# EAGLE design ABoatMon (EAGLE 9.5.2)
CNAME: MoteinoMega ABoatMon Shield; CREVISION: 0.92; DESIGNER: gregcope@gmail.com
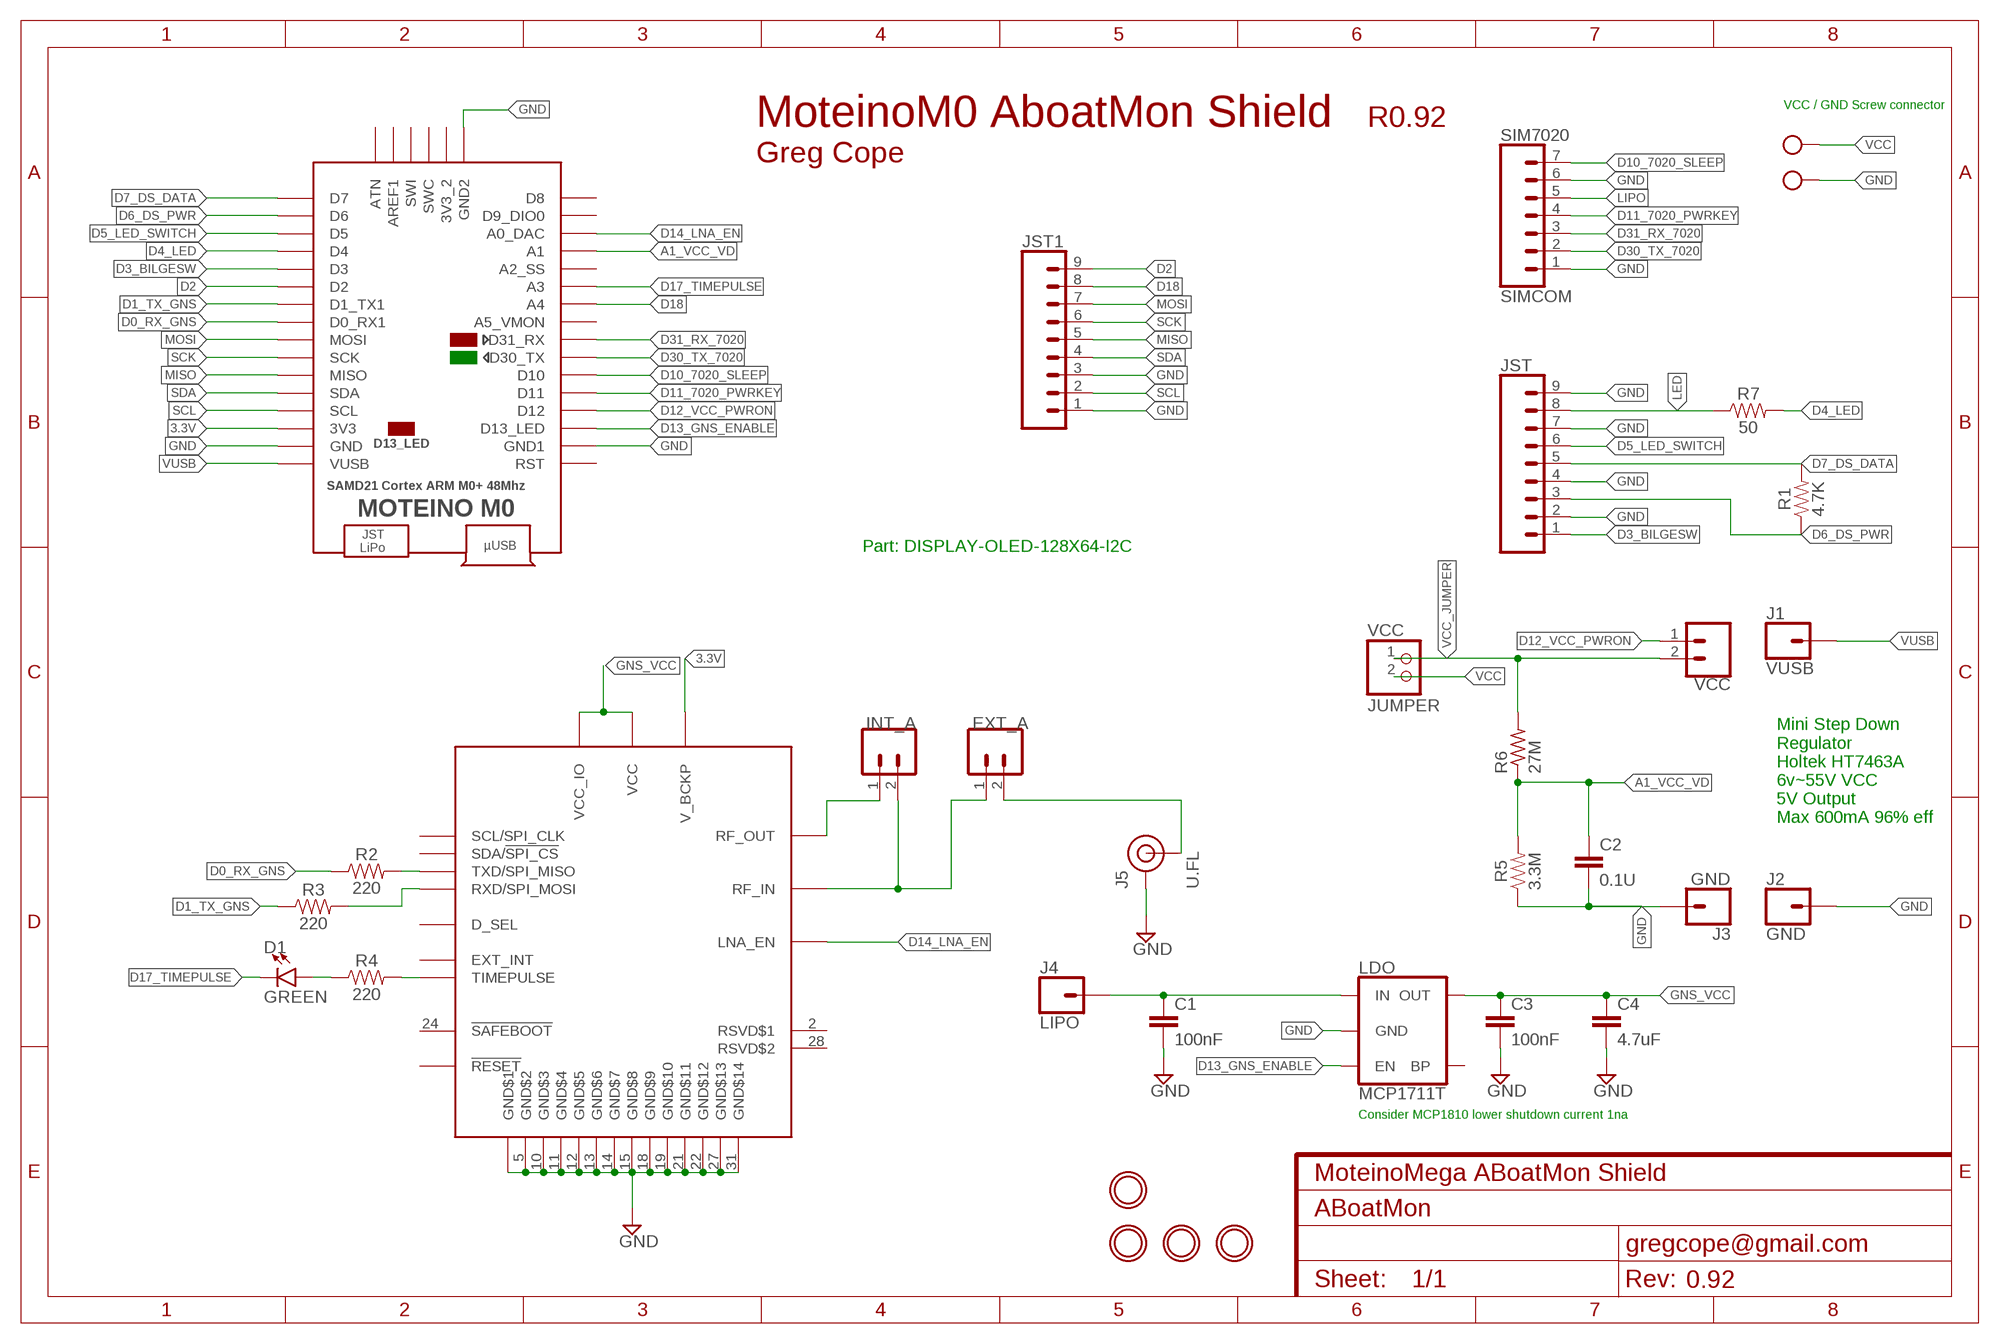
[diagram p0: schematic, sheet 1]

## Parts
C1  100nF  0.1UF-0603-25V-5%  [0603]
C2  0.1U  0.1UF-KIT-EZ-50V-20%  [CAP-PTH-SMALL-KIT]
C3  100nF  0.1UF-0603-25V-5%  [0603]
C4  4.7uF  4.7UF0603  [0603]
D1  GREEN  LED-GREEN0603  [LED-0603]
ENABLE  VCC  CONN_02  [1X02]
EXT_A  CONN_02  [1X02]
GND  MOUNTINGHOLE2.5  [MOUNTINGHOLE_2.5_PLATED]
INT_A  CONN_02  [1X02]
J1  VUSB  CONN_01  [1X01]
J2  GND  CONN_01  [1X01]
J3  GND  CONN_01  [1X01]
J4  LIPO  CONN_01  [1X01]
J5  U.FL  U.FL2PIN  [U.FL]
JST  CONN_09  [1X09]
JST1  CONN_09  [1X09]
LDO  MCP1711T  V_REG_SPX3819-SOT23-5  [SOT23-5]
R1  4.7K  1KOHM-HORIZ-1/4W-1%  [AXIAL-0.3]
R2  220  220OHM-0603-1/10W-1%  [0603]
R3  220  220OHM-0603-1/10W-1%  [0603]
R4  220  220OHM-0603-1/10W-1%  [0603]
R5  3.3M  1KOHM-HORIZ-1/4W-1%  [AXIAL-0.3]
R6  27M  R-US_0309/12  [0309/12]
R7  50  1KOHM-HORIZ-1/4W-1%  [AXIAL-0.3]
SIM7020  SIMCOM  CONN_07  [1X07]
U$3  MOUNTINGHOLE2.0  [MOUNTINGHOLE_2.0_PLATED]
U$5  CAM-M8  [CAM-M8]
U$6  MOTEINO_M0  [MOTEINO_M0]
U$7  MOUNTINGHOLE2.5  [MOUNTINGHOLE_2.5_PLATED]
U$9  MOUNTINGHOLE2.0  [MOUNTINGHOLE_2.0_PLATED]
VCC  JUMPER  HEADER-1X2ROUND  [1X02_ROUND]
X1  MKDSN1,5/2-5,08  [MKDSN1,5/2-5,08]

## Nets
3.3V [gns]: U$5.8(V_BCKP) U$6.3V3
A1_VCC_VD: C2.1 R5.P$2 R6.1 U$6.A1
D0_RX_GNS: R2.1 U$6.D0_RX1
D1_TX_GNS: R3.1 U$6.D1_TX1
D2: JST1.9 U$6.D2
D3_BILGESW: JST.1 U$6.D3
D4_LED: R7.P$2 U$6.D4
D5_LED_SWITCH: JST.6 U$6.D5
D6_DS_PWR: JST.3 R1.P$1 U$6.D6
D7_DS_DATA: JST.5 R1.P$2 U$6.D7
D10_7020_SLEEP: SIM7020.7 U$6.D10
D11_7020_PWRKEY: SIM7020.4 U$6.D11
D12_VCC_PWRON: ENABLE.1 U$6.D12
D13_GNS_ENABLE: LDO.3(EN) U$6.D13(D13_LED)
D14_LNA_EN: U$5.30(LNA_EN) U$6.A0_DAC
D17_TIMEPULSE: D1.C U$6.A3
D18: JST1.8 U$6.A4
D30_TX_7020: SIM7020.2 U$6.D30_TX
D31_RX_7020: SIM7020.3 U$6.D31_RX
GND [power]: C1.2 C2.2 C3.2 C4.2 J2.1 J3.1 J5.1(GND) J5.2(GND) JST1.1 JST1.3 JST.2 JST.4 JST.7 JST.9 LDO.2(GND) R5.P$1 SIM7020.1 SIM7020.6 U$5.4(GND$1) U$5.5(GND$2) U$5.10(GND$3) U$5.11(GND$4) U$5.12(GND$5) U$5.13(GND$6) U$5.14(GND$7) U$5.15(GND$8) U$5.18(GND$9) U$5.19(GND$10) U$5.21(GND$11) U$5.22(GND$12) U$5.27(GND$13) U$5.31(GND$14) U$6.GND U$6.GND_1(GND1) U$6.GND_2(GND2) X1.2
GNS_VCC [gns]: C3.1 C4.1 LDO.5(OUT) U$5.1(VCC_IO) U$5.9(VCC)
LED: JST.8 R7.P$1
LIPO: C1.1 J4.1 LDO.1(IN) SIM7020.5
MISO: JST1.5 U$6.MISO
MOSI: JST1.7 U$6.MOSI
N$1: R4.2 U$5.29(TIMEPULSE)
N$2 [gns]: R2.2 U$5.25(TXD/SPI_MISO)
N$3 [gns]: R3.2 U$5.26(RXD/SPI_MOSI)
N$4: D1.A R4.1
N$5 [gns]: EXT_A.1 INT_A.2 U$5.17(RF_IN)
N$6 [power]: EXT_A.2 J5.FEED(SIGNAL)
N$7 [gns]: INT_A.1 U$5.16(RF_OUT)
SCK: JST1.6 U$6.SCK
SCL: JST1.2 U$6.SCL
SDA: JST1.4 U$6.SDA
VCC [power]: VCC.2 X1.1
VCC_JUMPER [power]: ENABLE.2 R6.2 VCC.1
VUSB [power]: J1.1 U$6.VUSB
Unconnected: LDO.4(BP) U$5.2(RSVD$1) U$5.3(SDA/!SPI_CS) U$5.6(SCL/SPI_CLK) U$5.7(EXT_INT) U$5.20(D_SEL) U$5.23(!RESET) U$5.24(!SAFEBOOT) U$5.28(RSVD$2) U$6.3V3_2 U$6.A2(A2_SS) U$6.A5(A5_VMON) U$6.AREF(AREF1) U$6.ATN U$6.D8 U$6.D9(D9_DIO0) U$6.RST U$6.SWC U$6.SWI

## Notes on the sheet
- VCC / GND Screw connector
- MoteinoM0 AboatMon Shield | R0.92
- Greg Cope
- Part: DISPLAY-OLED-128X64-I2C
- Mini Step Down 
  Regulator
  Holtek HT7463A
  6v~55V VCC
  5V Output
  Max 600mA 96% eff
- Consider MCP1810 lower shutdown current 1na

## Library data of the parts
C1 C3 = SparkFun-Capacitors:0.1UF: 0.1µF ceramic capacitors A capacitor is a passive two-terminal electrical component used to store electrical energy temporarily in an electric field.; PROD_ID: CAP-08604; VALUE: 0.1uF
C2 = SparkFun-Capacitors:0.1UF: 0.1µF ceramic capacitors A capacitor is a passive two-terminal electrical component used to store electrical energy temporarily in an electric field.; PROD_ID: CAP-08370; VALUE: 0.1uF
C4 = SparkFun-Capacitors:4.7UF: 4.7µF ceramic capacitors A capacitor is a passive two-terminal electrical component used to store electrical energy temporarily in an electric field.; PROD_ID: CAP-08280
D1 = SparkFun-LED:LED-GREEN: Green SMD LED Used in manufacturing of various products at SparkFun Packages: 0603 - SMD 0603 package [Product Link] <http://www.futureelectronics.com/en/technologies/semiconductors/optoelectronics/leds/Pages/9894312-LTST-C190GKT.aspx?CrossPart=HSMG-C190&IM=0> LilyPad 1206 - SMD1206 LilyPad package [Product Link] <http://www.futureelectronics.com/en/Technologies/Product.aspx?ProductID=IN150NGHARVATEKCORPORATION2049943&IM=0> 1206 - SMD1206 package [Product Link] <http://www.futureelectronics.com/en/technologies/semiconductors/optoelectronics/leds/Pages/8315665-LTST-C150KGKT.aspx?IM=0> 1206 Bottom Mount -SMD 1206 Bottom Mount [Product Link] <http://www.digikey.com/product-detail/en/lite-on-inc/LTST-C230KGKT/160-1456-1-ND/386854> SparkFun Products: Pro Mini 328 -5V <https://www.sparkfun.com/products/821> RedBoard <https://www.sparkfun.com/products/12757> MP3 Trigger <https://www.sparkfun.com/products/13720> Makey Makey <https://www.sparkfun.com/products/11076>; PROD_ID: DIO-00821
ENABLE EXT_A INT_A = SparkFun-Connectors:CONN_02: Multi connection point. Often used as Generic Header-pin footprint for 0.1 inch spaced/style header connections On any of the 0.1 inch spaced packages, you can populate with these: Break Away Headers - Straight <https://www.sparkfun.com/products/116> (PRT-00116) Break Away Male Headers - Right Angle <https://www.sparkfun.com/products/553> (PRT-00553) Female Headers <https://www.sparkfun.com/products/115> (PRT-00115) Break Away Headers - Machine Pin <https://www.sparkfun.com/products/117> (PRT-00117) Break Away Female Headers - Swiss Machine Pin <https://www.sparkfun.com/products/743> (PRT-00743) For SCREWTERMINALS and SPRING TERMINALS visit here: Screw Terimnals on SparkFun.com <https://www.sparkfun.com/search/results?term=Screw+Terminals> (5mm/3.5mm/2.54mm spacing) This device is also useful as a general connection point to wire up your design to another part of your project. Our various solder wires solder well into these plated through hole pads. Hook-Up Wire - Assortment (Stranded, 22 AWG) <https://www.sparkfun.com/products/11375> (PRT-11375) Hook-Up Wire - Assortment (Solid Core, 22 AWG) <https://www.sparkfun.com/products/11367> (PRT-11367) View the entire wire category on our website here <https://www.sparkfun.com/categories/141> Special notes: Molex polarized connector foot print use with: PRT-08233 with associated crimp pins and housings. 2.54_SCREWTERM for use with PRT-10571. 3.5mm Screw Terminal footprints for PRT-08084 5mm Screw Terminal footprints for use with PRT-08432
GND U$3 U$7 U$9 = microbuilder:MOUNTINGHOLE: Mounting Hole For #2 screws (0.086"/2.18mm width, 0.094"/2.4mm hole) use 2.5mm
J1-J4 = SparkFun-Connectors:CONN_01: Single connection point. Often used as Generic Header-pin footprint for 0.1 inch spaced/style header connections On any of the 0.1 inch spaced packages, you can populate with these: Break Away Headers - Straight <https://www.sparkfun.com/products/116> (PRT-00116) Break Away Male Headers - Right Angle <https://www.sparkfun.com/products/553> (PRT-00553) Female Headers <https://www.sparkfun.com/products/115> (PRT-00115) Break Away Headers - Machine Pin <https://www.sparkfun.com/products/117> (PRT-00117) Break Away Female Headers - Swiss Machine Pin <https://www.sparkfun.com/products/743> (PRT-00743) This device is also useful as a general connection point to wire up your design to another part of your project. Our various solder wires solder well into these plated through hole pads. Hook-Up Wire - Assortment (Stranded, 22 AWG) <https://www.sparkfun.com/products/11375> (PRT-11375) Hook-Up Wire - Assortment (Solid Core, 22 AWG) <https://www.sparkfun.com/products/11367> (PRT-11367) View the entire wire category on our website here <https://www.sparkfun.com/categories/141> Special notes: SMTSO-256-ET is a "flush mount" nut for a 4-40 screw. We mostly use this on specialty testbeds; it is a nice way to connect hardware to your PCB at an adjustable hieght. Also note, the SNAP packages are for using a snappable style connector. We sell a baggie of snaps and they are also used on two LilyPad designs: Snap Assortment - 30 pack (male and female) <https://www.sparkfun.com/products/11347> (DEV-11347) LilyPad Arduino SimpleSnap <https://www.sparkfun.com/products/10941> (DEV-10941) LilyPad SimpleSnap Protoboard <https://www.sparkfun.com/products/10940> (DEV-10940)
J5 = SparkFun-Connectors:U.FL2PIN: SMD Antenna Connector - U.FL 2mm height, 3.0mm x 3.0mm receptacle size. SparkFun Products: SparkFun WiFi Shield - ESP8266 <https://www.sparkfun.com/products/13287> SparkFun ESP8266 Thing <https://www.sparkfun.com/products/13231> SparkFun MiniGen - Pro Mini Signal Generator Shield <https://www.sparkfun.com/products/11420>; PROD_ID: CONN-09193; SF_ID: WRL-09144
JST JST1 = SparkFun-Connectors:CONN_09: Multi connection point. Often used as Generic Header-pin footprint for 0.1 inch spaced/style header connections On any of the 0.1 inch spaced packages, you can populate with these: Break Away Headers - Straight <https://www.sparkfun.com/products/116> (PRT-00116) Break Away Male Headers - Right Angle <https://www.sparkfun.com/products/553> (PRT-00553) Female Headers <https://www.sparkfun.com/products/115> (PRT-00115) Break Away Headers - Machine Pin <https://www.sparkfun.com/products/117> (PRT-00117) Break Away Female Headers - Swiss Machine Pin <https://www.sparkfun.com/products/743> (PRT-00743) For SCREWTERMINALS and SPRING TERMINALS visit here: Screw Terimnals on SparkFun.com <https://www.sparkfun.com/search/results?term=Screw+Terminals> (5mm/3.5mm/2.54mm spacing) This device is also useful as a general connection point to wire up your design to another part of your project. Our various solder wires solder well into these plated through hole pads. Hook-Up Wire - Assortment (Stranded, 22 AWG) <https://www.sparkfun.com/products/11375> (PRT-11375) Hook-Up Wire - Assortment (Solid Core, 22 AWG) <https://www.sparkfun.com/products/11367> (PRT-11367) View the entire wire category on our website here <https://www.sparkfun.com/categories/141> Special notes: Molex polarized connector foot print use with SKU : PRT-08231 with associated crimp pins and housings. 1MM SMD Version SKU: PRT-10208 NOTES ON THE VARIANTS LOCK and LOCK_LONGPADS... This footprint was designed to help hold the alignment of a through-hole component (i.e. 6-pin header) while soldering it into place. You may notice that each hole has been shifted either up or down by 0.005 of an inch from it's more standard position (which is a perfectly straight line). This slight alteration caused the pins (the squares in the middle) to touch the edges of the holes. Because they are alternating, it causes a "brace" to hold the component in place. 0.005 has proven to be the perfect amount of "off-center" position when using our standard breakaway headers. Although looks a little odd when you look at the bare footprint, once you have a header in there, the alteration is very hard to notice. Also,if you push a header all the way into place, it is covered up entirely on the bottom side.
LDO = SparkFun-IC-Power:V_REG_SPX3819: SPX3819 Voltage Regulator 3.3V 500mA, 16V input Datasheet <https://www.exar.com/content/document.ashx?id=22106> SparkFun Products: SparkFun Serial Controlled Motor Driver <https://www.sparkfun.com/products/13911>; PROD_ID: VREG-13321; VALUE: SPX3819M5_3_3
R1 R5 R7 = SparkFun-Resistors:1KOHM: 1kΩ resistor A resistor is a passive two-terminal electrical component that implements electrical resistance as a circuit element. Resistors act to reduce current flow, and, at the same time, act to lower voltage levels within circuits. - Wikipedia; PROD_ID: RES-12182; VALUE: 1k
R2-R4 = SparkFun-Resistors:220OHM: 220Ω resistor A resistor is a passive two-terminal electrical component that implements electrical resistance as a circuit element. Resistors act to reduce current flow, and, at the same time, act to lower voltage levels within circuits. - Wikipedia; PROD_ID: RES-07861
R6 = adafruit:R-US_: RESISTOR, American symbol
SIM7020 = SparkFun-Connectors:CONN_07: Multi connection point. Often used as Generic Header-pin footprint for 0.1 inch spaced/style header connections On any of the 0.1 inch spaced packages, you can populate with these: Break Away Headers - Straight <https://www.sparkfun.com/products/116> (PRT-00116) Break Away Male Headers - Right Angle <https://www.sparkfun.com/products/553> (PRT-00553) Female Headers <https://www.sparkfun.com/products/115> (PRT-00115) Break Away Headers - Machine Pin <https://www.sparkfun.com/products/117> (PRT-00117) Break Away Female Headers - Swiss Machine Pin <https://www.sparkfun.com/products/743> (PRT-00743) For SCREWTERMINALS and SPRING TERMINALS visit here: Screw Terimnals on SparkFun.com <https://www.sparkfun.com/search/results?term=Screw+Terminals> (5mm/3.5mm/2.54mm spacing) This device is also useful as a general connection point to wire up your design to another part of your project. Our various solder wires solder well into these plated through hole pads. Hook-Up Wire - Assortment (Stranded, 22 AWG) <https://www.sparkfun.com/products/11375> (PRT-11375) Hook-Up Wire - Assortment (Solid Core, 22 AWG) <https://www.sparkfun.com/products/11367> (PRT-11367) View the entire wire category on our website here <https://www.sparkfun.com/categories/141> Special notes: Molex polarized connector foot print use with SKU : PRT-08231 with associated crimp pins and housings. 1MM SMD Version SKU: PRT-10208 NOTES ON THE VARIANTS LOCK and LOCK_LONGPADS... This footprint was designed to help hold the alignment of a through-hole component (i.e. 6-pin header) while soldering it into place. You may notice that each hole has been shifted either up or down by 0.005 of an inch from it's more standard position (which is a perfectly straight line). This slight alteration caused the pins (the squares in the middle) to touch the edges of the holes. Because they are alternating, it causes a "brace" to hold the component in place. 0.005 has proven to be the perfect amount of "off-center" position when using our standard breakaway headers. Although looks a little odd when you look at the bare footprint, once you have a header in there, the alteration is very hard to notice. Also,if you push a header all the way into place, it is covered up entirely on the bottom side.
U$5 = ubloxLib:CAM-M8: CAM-M8x: M8 Concurrent GNSS Antenna Module u-blox.com
U$6 = Moteino:MOTEINO_M0
VCC = microbuilder:HEADER-1X2: PIN HEADER
X1 = con-phoenix-508:MKDSN1,5/2-5,08: MKDSN 1,5/ 2-5,08 Printklemme Nennstrom: 13,5 A Nennspannung: 250 V Rastermaß: 5,08 mm Polzahl: 2 Anschlussart: Schraubanschluss Montage: Löten Anschlussrichtung Leiter/Platine: 0 ° Artikelnummer: 1729128 Source: http://eshop.phoenixcontact.com .. 1729128.pdf

## Net classes
0 default: width 0.457 mm, clearance 0.305 mm
1 power: width 0.61 mm, clearance 0.406 mm

## Board
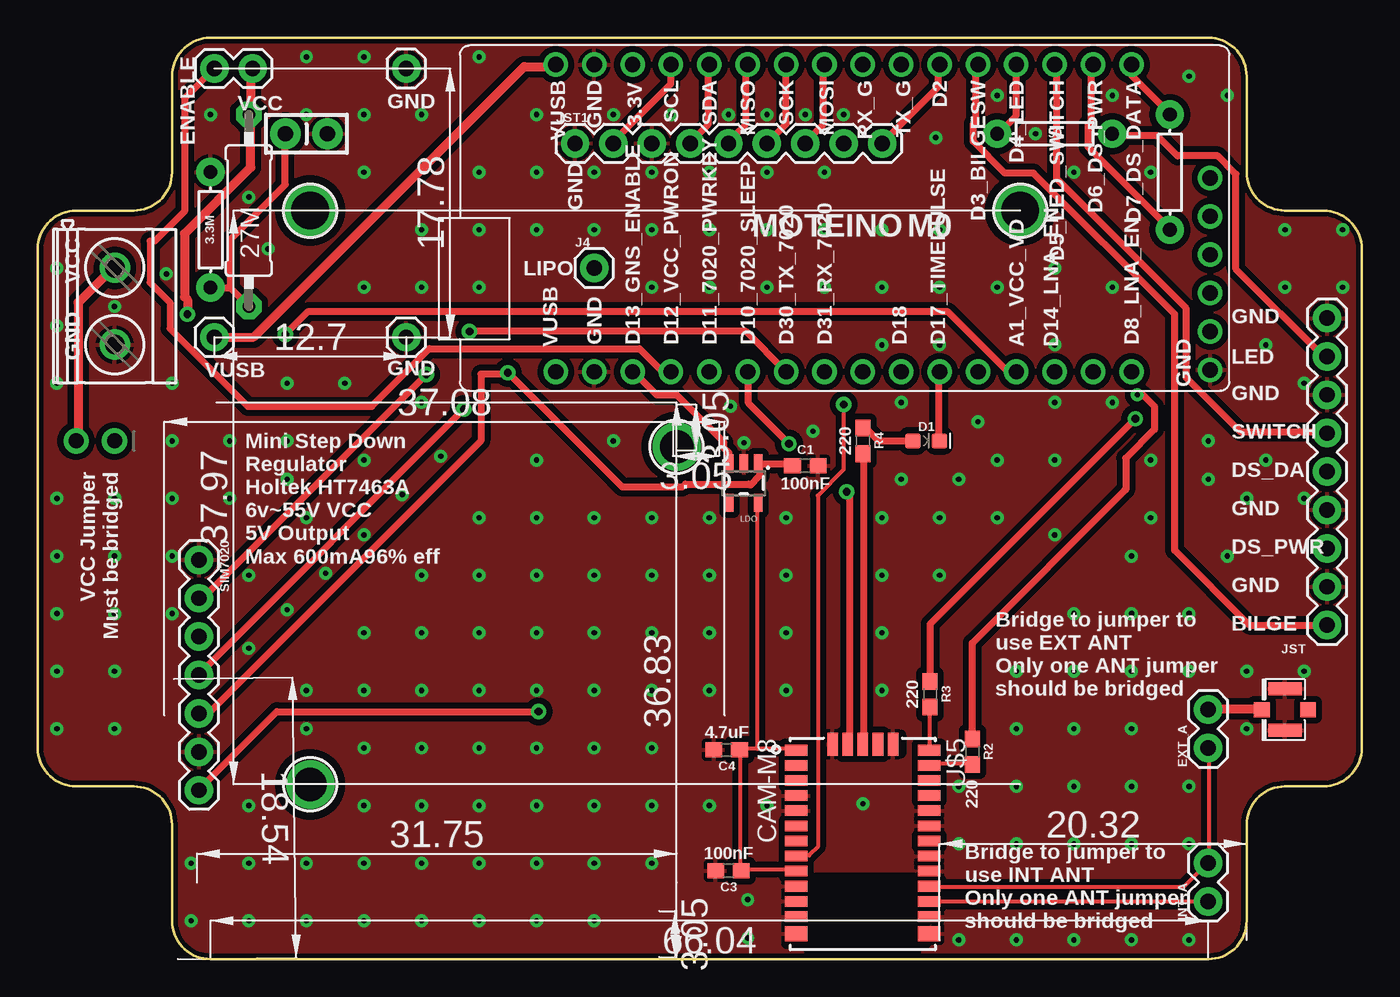
[diagram p1: board, top side]
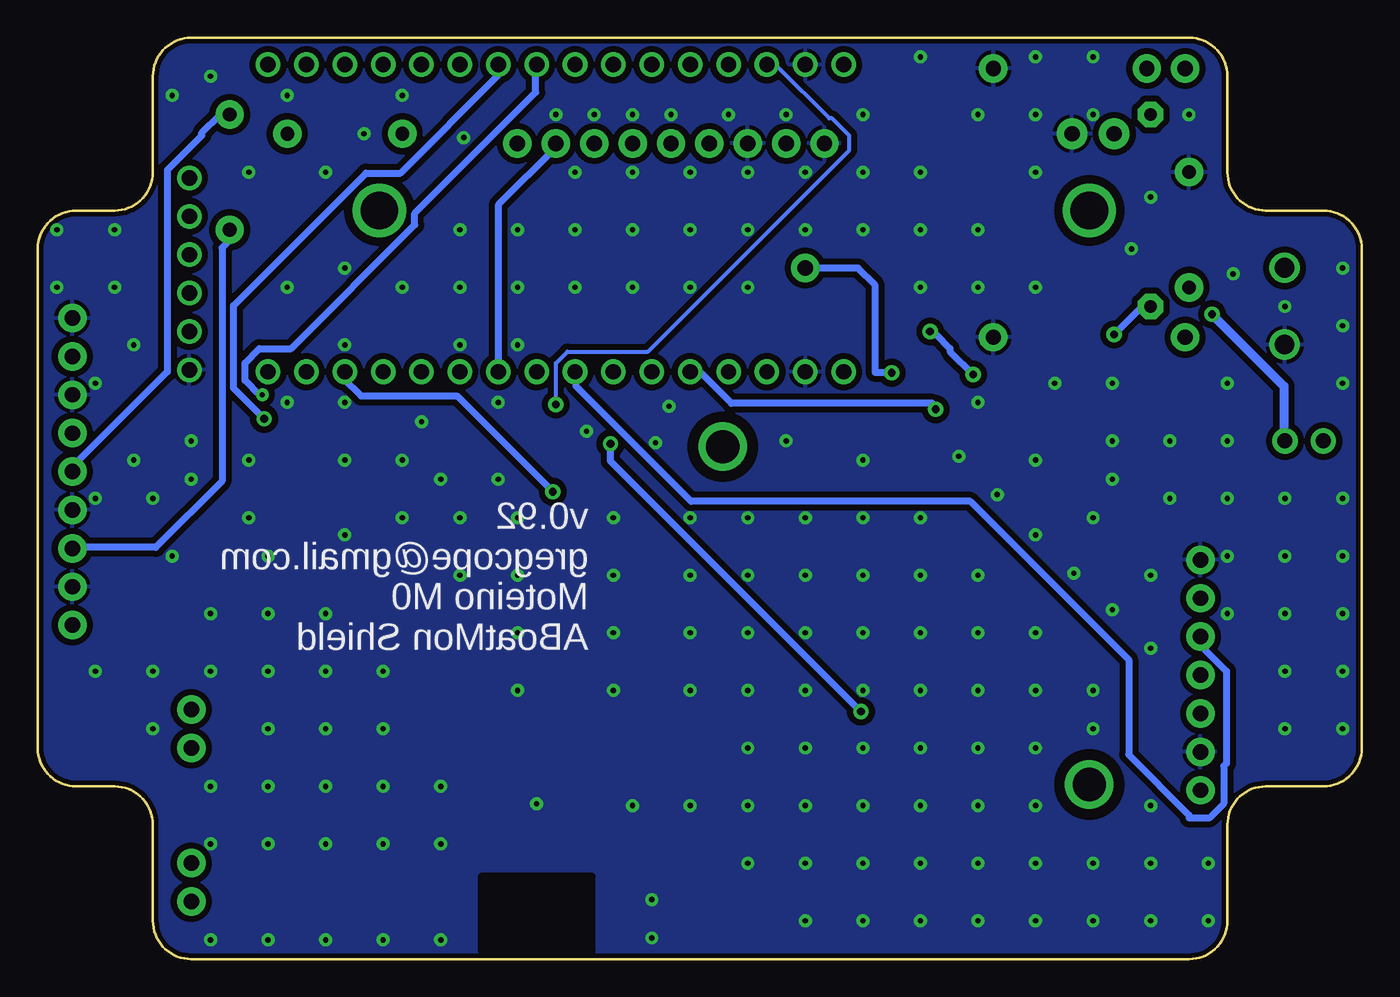
[diagram p2: board, bottom side, seen from below]

Size 87.63 x 60.96 mm. Coordinates in mm from the lower left corner, seen from the top.
Outline: 11.43,0 77.47,0 arc90 80.01,2.54 80.01,8.89 arc-90 82.55,11.43 85.09,11.43 arc90 87.63,13.97 87.63,46.99 arc90 85.09,49.53 82.55,49.53 arc-90 80.01,52.07 80.01,58.42 arc90 77.47,60.96 11.43,60.96 arc90 8.89,58.42 8.89,52.07 arc-90 6.35,49.53 2.54,49.53 arc90 0,46.99 0,13.97 arc90 2.54,11.43 6.35,11.43 arc-90 8.89,8.89 8.89,2.54 arc90 11.43,0
Copper layers (1*16): Top 0.035mm / dielectric 1.5mm / Bottom 0.035mm
Design rules "SparkFun-2-layer-STANDARD": minimum track width 10mil, minimum drill 20mil, track to track 10mil, track to pad 8mil, pad to pad 8mil, via to via 10mil, smd to smd 8mil, copper to edge 8mil, drill to drill 8mil, minimum pad ring 10mil, minimum via ring 10mil, stop-mask expansion 4mil, vias tented up to drill 25mil, thermal gap 10mil
tRestrict: 10 lines

### Footprints (pad centres in the part's own frame; a part is rotated, then mirrored left to right if it is on the bottom)
0603 = smd 1.1 x 1: 1 -0.85,0; 2 0.85,0
CAP-PTH-SMALL-KIT = drill 1.016 pad 2.032: 1 -1.397,0; 2 1.397,0
LED-0603 = smd 1 x 1: A -0.877,0; C 0.877,0
1X02 = drill 1.016 pad 1.88: 1 0,0; 2 2.54,0
MOUNTINGHOLE_2.5_PLATED = drill 2.5 pad 3.2: P$1 0,0
1X01 = drill 1.016 pad 1.88: 1 0,0
U.FL = smd 2.2 x 0.85: 1 0,1.375; 2 0,-1.375 | smd 1.05 x 1: FEED 1.525,0; NC -1.525,0
1X09 = drill 1.016 pad 1.88: 1 0,0; 2 2.54,0; 3 5.08,0; 4 7.62,0; 5 10.16,0; 6 12.7,0; 7 15.24,0; 8 17.78,0; 9 20.32,0
SOT23-5 = smd 0.55 x 1.2: 1 -0.95,-1.3; 2 0,-1.3; 3 0.95,-1.3; 4 0.95,1.3; 5 -0.95,1.3
AXIAL-0.3 = drill 0.9 pad 1.88: P$1 -3.81,0; P$2 3.81,0
0309/12 = drill 0.813 pad 1.676 octagon: 1 -6.35,0; 2 6.35,0
1X07 = drill 1.016 pad 1.88: 1 0,0; 2 2.54,0; 3 5.08,0; 4 7.62,0; 5 10.16,0; 6 12.7,0; 7 15.24,0
MOUNTINGHOLE_2.0_PLATED = drill 2.2 pad 3: P$1 0,0
CAM-M8 = smd 0.7 x 1.5: 1 -6.2,-4.4; 2 -5.2,-4.4; 3 -4.2,-4.4; 4 -3.2,-4.4; 5 -2.2,-4.4; 6 -1.2,-4.4; 7 -0.2,-4.4; 8 0.8,-4.4; 9 1.8,-4.4; 10 2.8,-4.4; 11 3.8,-4.4; 12 4.8,-4.4; 15 4.8,4.4; 16 3.8,4.4; 17 2.8,4.4; 18 1.8,4.4; 19 0.8,4.4; 20 -0.2,4.4; 21 -1.2,4.4; 22 -2.2,4.4; 23 -3.2,4.4; 24 -4.2,4.4; 25 -5.2,4.4; 26 -6.2,4.4 | smd 1 x 1.5: 13 5.95,-4.4; 14 5.95,4.4 | smd 1.5 x 0.7: 27 -6.6,2; 28 -6.6,1; 29 -6.6,0; 30 -6.6,-1; 31 -6.6,-2
MOTEINO_M0 = drill 1.016 pad 1.626: 3V3 11.43,22.352; 3V3_2 49.657,4.699; A0_DAC 39.37,2.032; A1 36.83,2.032; A2 34.29,2.032; A3 31.75,2.032; A4 29.21,2.032; A5 26.67,2.032; AREF 49.657,12.319; ATN 49.657,14.859; D0_RX1 26.67,22.352; D1_TX1 29.21,22.352; D2 31.75,22.352; D3 34.29,22.352; D4 36.83,22.352; D5 39.37,22.352; D6 41.91,22.352; D7 44.45,22.352; D8 44.45,2.032; D9 41.91,2.032; D10 19.05,2.032; D11 16.51,2.032; D12 13.97,2.032; D13 11.43,2.032; D30_TX 21.59,2.032; D31_RX 24.13,2.032; GND 8.89,22.352; GND_1 8.89,2.032; GND_2 49.657,2.159; MISO 19.05,22.352; MOSI 24.13,22.352; RST 6.35,2.032; SCK 21.59,22.352; SCL 13.97,22.352; SDA 16.51,22.352; SWC 49.657,7.239; SWI 49.657,9.779; VUSB 6.35,22.352
1X02_ROUND = drill 1 pad 1.676: 1 -1.27,0; 2 1.27,0
MKDSN1,5/2-5,08 = drill 1.3 pad 2: 1 -2.561,0.025; 2 2.519,0.025

### Placement (x,y rotation side)
C1  50.8,32.64 0 top
C2  17.78,54.61 0 top
C3  45.72,5.84 180 top
C4  45.59,13.84 180 top
D1  58.8,34.29 0 top
ENABLE  11.68,58.93 0 top
EXT_A  77.47,13.97 90 top
GND  18.03,49.53 0 top
INT_A  77.47,3.81 90 top
J1  11.68,41.15 0 top
J2  24.38,41.15 0 top
J3  24.38,58.93 0 top
J4  36.83,45.72 0 top
J5  82.55,16.51 180 top
JST  85.34,22.1 90 top
JST1  35.56,53.98 0 top
LDO  46.74,31.5 180 top
R1  74.93,52.07 90 top
R2  61.85,13.72 270 top
R3  59.05,17.53 270 top
R4  54.61,34.29 270 top
R5  11.43,48.26 270 top
R6  13.97,49.53 90 top
R7  67.31,54.61 180 top
SIM7020  10.67,26.42 270 top
U$3  42.29,33.91 0 top
U$5  54.61,7.62 270 top
U$6  27.94,36.83 0 top
U$7  65.02,49.53 0 top
U$9  18.03,11.56 0 top
VCC  3.81,34.29 180 top
X1  5.08,43.18 270 top

### Tracks (layer width: path | path; a pad name or v marks a point on that pad's centre or on a via)
3.3V  (via drill 0.51)
  Top 0.254: v53.34,36.7 53.34,32.38 51.63,30.67 51.63,7.43 51.05,6.86 50.29,6.86 U$5.8
  Bottom 0.254: v53.34,36.7 53.34,39.43 52.58,40.2 47.24,40.2 33.91,53.53 33.91,54.48 35.05,55.63 35.24,55.63 38.67,59.05 39.24,59.05 U$6.3V3
A1_VCC_VD  (via drill 0.51)
  Top 0.457: 12.76,44.39 11.43,44.39 R5.P$2 | R6.1 12.76,44.39 | C2.1 16.38,51.24 12.76,47.62 12.76,44.39 | U$6.A1 64.2,38.86 60.2,42.86 17.91,42.86 v16.38,41.34
  Bottom 0.457: v16.38,41.34 14.67,43.05 14.1,43.05 R6.1
D0_RX_GNS  (via drill 0.33)
  Top 0.457: R2.1 61.85,20.92 71.88,30.95 72.01,31.05 72.01,33.15 73.91,35.05 73.91,36.58 73.15,37.34 v72.77,37.34
  Bottom 0.457: v72.77,37.34 72.96,37.34 73.91,38.29 73.91,39.43 72.96,40.39 70.87,40.39 62.67,48.58 62.67,49.34 54.67,57.34 54.67,59.05 U$6.D0_RX1
D1_TX_GNS  (via drill 0.51)
  Top 0.457: v72.64,35.75 59.05,22.16 R3.1
  Bottom 0.457: v72.64,35.75 74.68,37.78 74.68,43.24 65.91,52.01 63.63,52.01 57.15,58.48 U$6.D1_TX1
D2
  Top 0.457: JST1.9 59.63,57.72 59.63,59.05 U$6.D2
D3_BILGESW
  Top 0.457: U$6.D3 62.1,59.05 62.1,55.44 61.91,55.24 61.91,54.1 64.01,52.01 65.91,52.01 75.25,42.67 75.25,27.05 80.2,22.1 JST.1
D4_LED
  Top 0.457: U$6.D4 64.77,55.82 63.63,54.67 R7.P$2
D5_LED_SWITCH
  Top 0.457: U$6.D5 67.44,59.05 67.44,51.63 76.01,43.05 76.01,38.48 79.63,34.86 85.28,34.86 JST.6
D6_DS_PWR
  Top 0.457: U$6.D6 69.72,59.05 69.72,55.44 69.53,55.24 69.53,53.72 74.87,48.39 R1.P$1
  Bottom 0.457: JST.3 85.28,27.24 79.82,27.24 75.44,31.62 75.44,47.05 75.06,47.43 75.06,48.2 R1.P$1
D7_DS_DATA
  Top 0.457: U$6.D7 72.39,58.48 74.87,56.01 R1.P$2
  Bottom 0.457: R1.P$2 75.06,55.82 75.63,55.82 76.77,54.67 76.77,54.48 79.06,52.2 79.06,38.86 85.34,32.58 JST.5
D10_7020_SLEEP  (via drill 0.51)
  Top 0.457: v49.72,34.1 47.05,36.77 47.05,38.86 U$6.D10 | v33.15,16.38 15.81,16.38 10.67,11.24 SIM7020.7
  Bottom 0.457: v49.72,34.1 49.72,32.96 v33.15,16.38
D11_7020_PWRKEY  (via drill 0.51)
  Top 0.457: v28.19,36.39 10.67,18.86 SIM7020.4
  Bottom 0.457: U$6.D11 43.81,38.86 41.72,36.77 28.38,36.77 28.38,36.58 v28.19,36.39
D12_VCC_PWRON
  Top 0.457: U$6.D12 41.34,38.86 39.81,40.39 25.91,40.39 22.1,36.58 13.91,36.58 8.76,41.72 8.76,43.43 7.43,44.77 7.43,47.5 7.75,47.5 9.72,49.47 9.72,56.96 ENABLE.1
D13_GNS_ENABLE
  Top 0.457: LDO.3 45.72,32.96 45.72,33.53 45.4,33.85 45.4,34.23 42.29,37.34 40.96,37.34 39.43,38.86 U$6.D13
D14_LNA_EN  (via drill 0.51)
  Top 0.457: v53.53,30.92 53.72,30.73 53.72,14.29 U$5.30
  Bottom 0.457: v53.53,30.92 59.88,37.27 66.23,37.27 67.44,38.48 67.44,38.86 U$6.A0_DAC
D17_TIMEPULSE
  Top 0.457: D1.C 59.63,34.29 59.63,38.86 U$6.A3
D18
  Bottom 0.457: U$6.A4 57.15,49.91 53.34,53.72 JST1.8
D30_TX_7020  (via drill 0.51)
  Top 0.457: v28.57,41.53 46.86,41.53 U$6.D30_TX | v25.72,38.67 11.05,24 10.67,24 SIM7020.2
  Bottom 0.457: v25.72,38.67 27.24,40.2 27.24,40.39 28.19,41.34 v28.57,41.53
D31_RX_7020
  Bottom 0.457: U$6.D31_RX 52.01,38.86 52.01,37.91 44.39,30.29 25.91,30.29 15.43,19.81 15.43,13.53 11.43,9.53 11.43,9.34 10.1,9.34 9.14,10.29 9.14,12.76 8.95,12.95 8.95,19.05 10.67,20.77 SIM7020.3
GND  (via drill 0.35)
  other vias: 68.58,52.07 73.66,52.07 66.04,54.61 63.5,57.15 8.51,45.34 13.97,50.42 71.12,57.15 67.31,28.07 54.61,10.29 46.99,1.4 46.99,3.94 76.2,58.42 46.74,34.16 17.78,6.35 21.59,6.35 21.59,2.54 13.97,2.54 17.78,2.54 21.59,10.16 13.97,6.35 10.16,6.35 10.16,2.54 5.08,15.24 5.08,19.05 5.08,22.86 5.08,26.67 5.08,30.48 21.59,13.97 25.4,13.97 29.21,13.97 25.4,10.16 25.4,6.35 25.4,2.54 29.21,2.54 33.02,2.54 33.02,6.35 29.21,6.35 29.21,10.16 33.02,10.16 33.02,13.97 36.83,13.97 40.64,13.97 40.64,17.78 44.45,17.78 40.64,21.59 44.45,21.59 44.45,25.4 36.83,2.54 36.83,6.35 36.83,10.16 40.64,6.35 40.64,10.16 44.45,10.16 55.88,25.4 59.69,25.4 55.88,21.59 55.88,17.78 55.88,29.21 59.69,29.21 63.5,29.21 63.5,33.02 67.31,33.02 67.31,36.83 71.12,36.83 67.31,40.64 63.5,44.45 59.69,44.45 59.69,40.64 44.45,48.26 48.26,48.26 52.07,48.26 40.64,48.26 33.02,48.26 29.21,52.07 29.21,48.26 25.4,48.26 15.24,46.99 21.59,52.07 21.59,55.88 25.4,55.88 21.59,59.69 17.78,59.69 17.78,55.88 11.43,55.88 29.21,59.69 33.02,52.07 59.69,48.26 71.12,44.45 78.74,57.15 77.47,34.29 77.47,31.75 73.66,33.02 83.82,19.05 80.01,15.24 76.2,11.43 80.01,19.05 76.2,19.05 76.2,22.86 72.39,22.86 72.39,26.67 73.66,29.21 68.58,22.86 64.77,19.05 68.58,19.05 72.39,19.05 72.39,15.24 72.39,11.43 68.58,11.43 68.58,15.24 64.77,15.24 64.77,11.43 60.96,11.43 60.96,7.62 64.77,7.62 64.77,1.27 68.58,1.27 72.39,1.27 76.2,1.27 76.2,7.62 72.39,7.62 68.58,7.62 60.96,1.27 57.15,36.83 49.53,29.21 49.53,25.4 49.53,21.59 49.53,17.78 48.26,10.16 1.27,30.48 1.27,26.67 1.27,22.86 1.27,19.05 1.27,15.24 8.89,38.1 1.27,38.1 1.27,41.91 1.27,45.72 5.08,43.18 13.97,10.16 25.4,17.78 29.21,17.78 33.02,17.78 36.83,17.78 36.83,21.59 33.02,21.59 29.21,21.59 25.4,21.59 21.59,17.78 8.89,30.48 21.59,21.59 51.31,34.92 29.21,25.4 33.02,29.21 33.02,25.4 36.83,25.4 36.83,29.21 40.64,29.21 40.64,25.4 44.45,29.21 29.21,29.21 62.23,35.56 33.02,33.02 57.15,31.75 25.4,25.4 45.85,36.58 60.96,31.75 12.7,30.48 17.78,17.78 17.78,15.24 8.89,34.29 12.7,34.29 16.51,34.29 16.51,31.75 16.51,38.1 20.32,38.1 25.4,44.45 29.21,44.45 21.59,44.45 40.64,44.45 44.45,44.45 48.26,44.45 52.07,44.45 55.88,44.45 55.88,40.64 67.31,45.72 40.64,52.07 36.83,52.07 36.83,48.26 44.45,52.07 48.26,52.07 52.07,52.07 55.88,48.26 59.44,54.36 78.74,26.67 83.82,30.48 80.01,30.48 81.28,33.02 83.82,38.1 81.28,40.64 82.55,44.45 86.36,44.45 86.36,48.26 82.55,48.26 33.02,55.88 38.1,55.88 41.91,55.88 45.72,55.88 48.26,55.88 50.8,55.88 53.34,55.88 38.1,34.29 8.89,22.86 8.89,26.67 21.59,33.02 17.78,29.21 13.97,25.4 25.4,36.83 19.05,25.53 21.59,28.07 24.13,30.73 26.67,33.27 16.51,23.11 13.97,20.57
  pour Top (isolate 0.305): 11.43,60.96 77.47,60.96 arc-90 80.01,58.42 80.01,52.07 arc90 82.55,49.53 85.09,49.53 arc-90 87.63,46.99 87.63,13.97 arc-90 85.09,11.43 82.55,11.43 arc90 80.01,8.89 80.01,2.54 arc-90 77.47,0 11.43,0 arc-90 8.89,2.54 8.89,8.89 arc90 6.35,11.43 2.54,11.43 arc-90 0,13.97 0,46.99 arc-90 2.54,49.53 6.35,49.53 arc90 8.89,52.07 8.89,58.42 arc-90
  pour Bottom (isolate 0.305): 11.43,60.96 77.47,60.96 arc-90 80.01,58.42 80.01,52.07 arc90 82.55,49.53 85.09,49.53 arc-90 87.63,46.99 87.63,13.97 arc-90 85.09,11.43 82.55,11.43 arc90 80.01,8.89 80.01,2.54 arc-90 77.47,0 11.43,0 arc-90 8.89,2.54 8.89,8.89 arc90 6.35,11.43 2.54,11.43 arc-90 0,13.97 0,46.99 arc-90 2.54,49.53 6.35,49.53 arc90 8.89,52.07 8.89,58.42 arc-90
GNS_VCC
  Top 0.254: 47.62,13.91 50.1,13.91 U$5.1 | 47.62,13.91 46.48,13.91 C4.1 46.48,13.72 46.48,5.91 C3.1 46.67,5.91 50.1,5.91 U$5.9 | 47.62,13.91 47.62,30.1 LDO.5
LED
  Top 0.457: JST.8 85.09,39.88 79.31,45.66 79.31,51.94 78.11,53.15 75.44,53.15 74.11,54.48 71.25,54.48 R7.P$1
LIPO  (via drill 0.51)
  Top 0.457: 47.82,32.77 49.91,32.77 C1.1 | 47.82,32.58 47.82,32 47.18,31.37 47.05,31.43 42.86,31.43 42.67,31.24 38.67,31.24 v31.11,38.8 31.02,38.7 29.34,38.7 29.34,34.29 11.3,16.26 SIM7020.5 | 47.82,32.77 LDO.1 47.82,32.58 | 47.82,32.58 47.82,32.77
  Bottom 0.457: J4.1 33.34,45.72 32.19,44.58 32.19,38.8 v31.11,38.8
MISO
  Top 0.457: U$6.MISO 46.86,59.05 46.86,55.24 45.72,54.1 JST1.5
MOSI
  Top 0.457: U$6.MOSI 52.01,59.05 52.01,55.24 50.86,54.1 JST1.7
N$1
  Top 0.457: R4.2 54.67,33.34 54.67,14.29 U$5.29
N$2
  Top 0.254: R2.2 61.72,12.95 59.05,12.95 U$5.25
N$3
  Top 0.254: R3.2 59.05,13.91 U$5.26
N$4
  Top 0.457: D1.A 55.63,34.29 54.67,35.24 R4.1
N$5
  Top 0.254: EXT_A.1 77.53,13.91 77.53,6.48 INT_A.2 77.34,6.29 75.82,4.76 59.05,4.76 U$5.17
N$6
  Top 0.61: EXT_A.2 77.53,16.57 81.15,16.57 J5.FEED
N$7
  Top 0.254: INT_A.1 59.05,3.81 U$5.16
SCK
  Top 0.457: U$6.SCK 49.53,55.24 JST1.6
SCL
  Top 0.457: U$6.SCL 41.91,57.91 38.1,54.1 JST1.2
SDA
  Top 0.457: U$6.SDA 44.39,59.05 44.39,55.24 43.24,54.1 JST1.4
VCC
  Top 0.61: VCC.2 2.67,34.29 2.67,43.43 4.95,45.72 X1.1
VCC_JUMPER  (via drill 0.51)
  Top 0.61: v9.91,42.67 9.91,43.62 9.72,43.81 9.72,48.01 14.1,52.39 14.1,55.63 R6.2 14.1,56.01 14.1,58.86 ENABLE.2
  Bottom 0.61: v9.91,42.67 5.14,37.91 5.14,34.29 VCC.1
VUSB
  Top 0.61: J1.1 14.29,41.15 32.19,59.05 34.29,59.05 U$6.VUSB

### Text on the board
tNames: VUSB | GND | 3.3V | SCL | SDA | MISO | SCK | MOSI | RX_G | TX_G | D2 | D3_BILGESW | D4_LED | D5_LED_SWITCH | D6_DS_PWR | D7_DS_DATA | GND | VCC | GND | VUSB | GND | D13_GNS_ENABLE | D12_VCC_PWRON | D11_7020_PWRKEY | D10_7020_SLEEP | D30_TX_7020 | D31_RX_7020 | D18 | D17_TIMEPULSE | A1_VCC_VD | D14_LNA_EN | D8_LNA_EN | GND | GND | LED | GND | GND | SWITCH | VCC Jumper / Must be bridged | DS_DA | GND | DS_PWR | Mini Step Down / Regulator / Holtek HT7463A / 6v~55V VCC / 5V Output / Max 600mA96% eff | GND | BILGE | Bridge to jumper to / use EXT ANT / Only one ANT jumper / should be bridged | Bridge to jumper to / use INT ANT / Only one ANT jumper / should be bridged
bNames: v0.92 / gregcope@gmail.com / Moteino M0 / ABoatMon Shield